# Altium project ITU_Rocket_Main_Board.PrjPcb
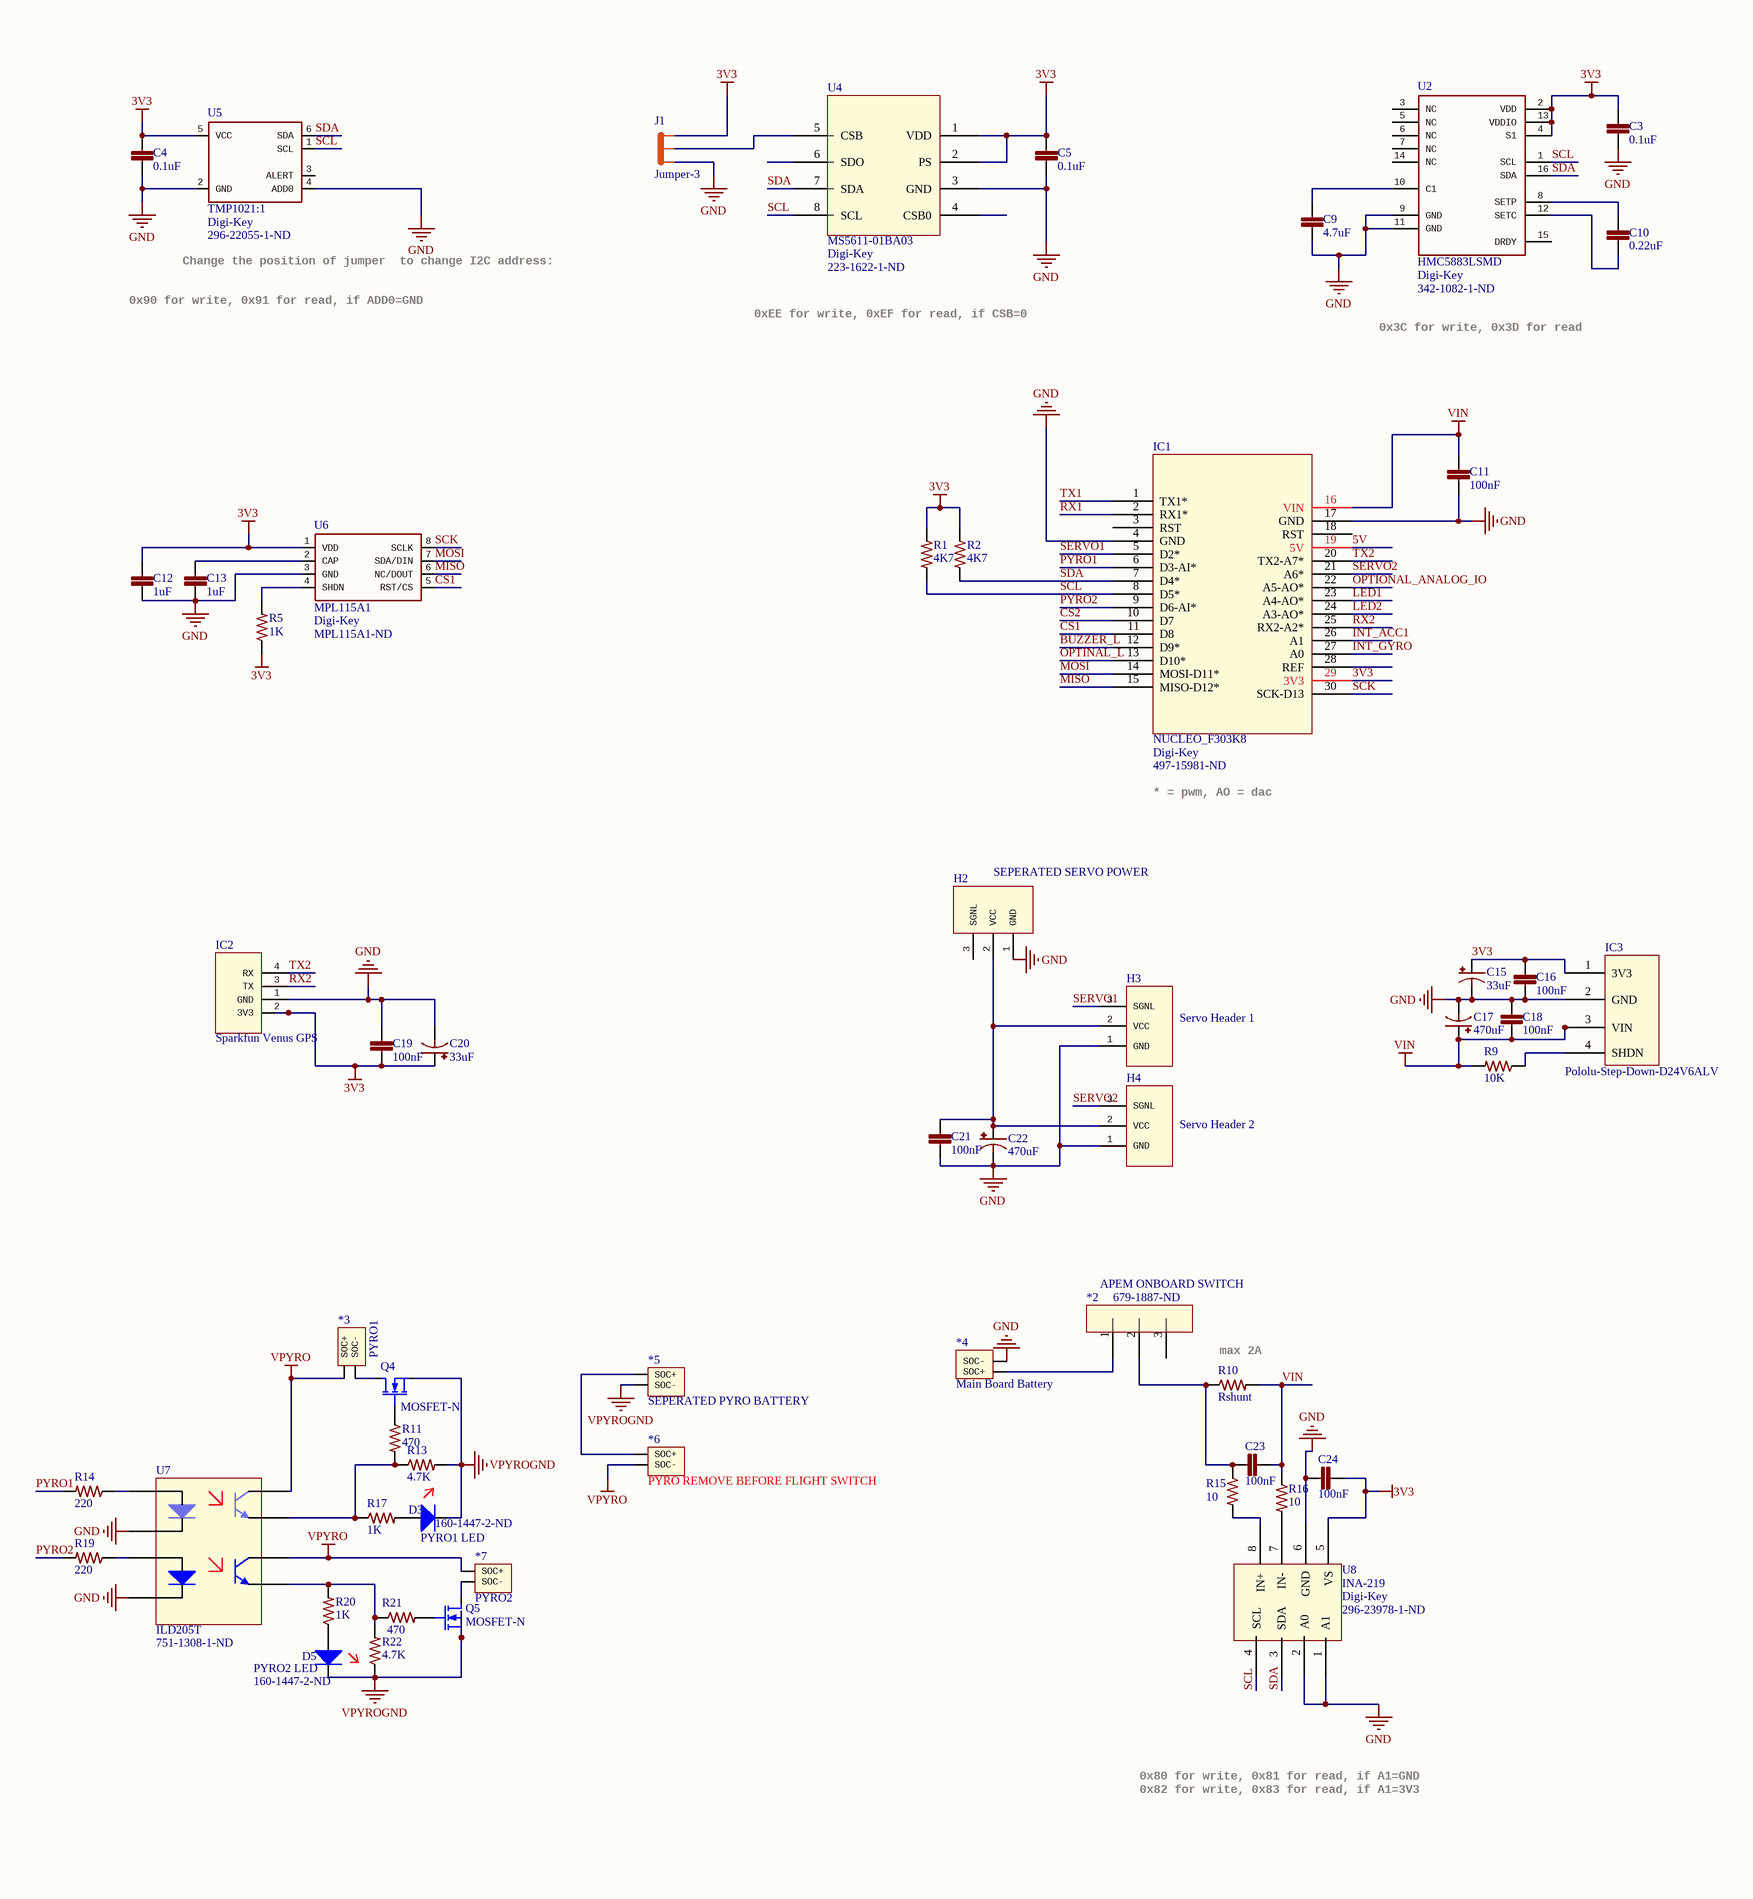
[diagram p0: ITU_Rocket_Main_Board.SchDoc, left]
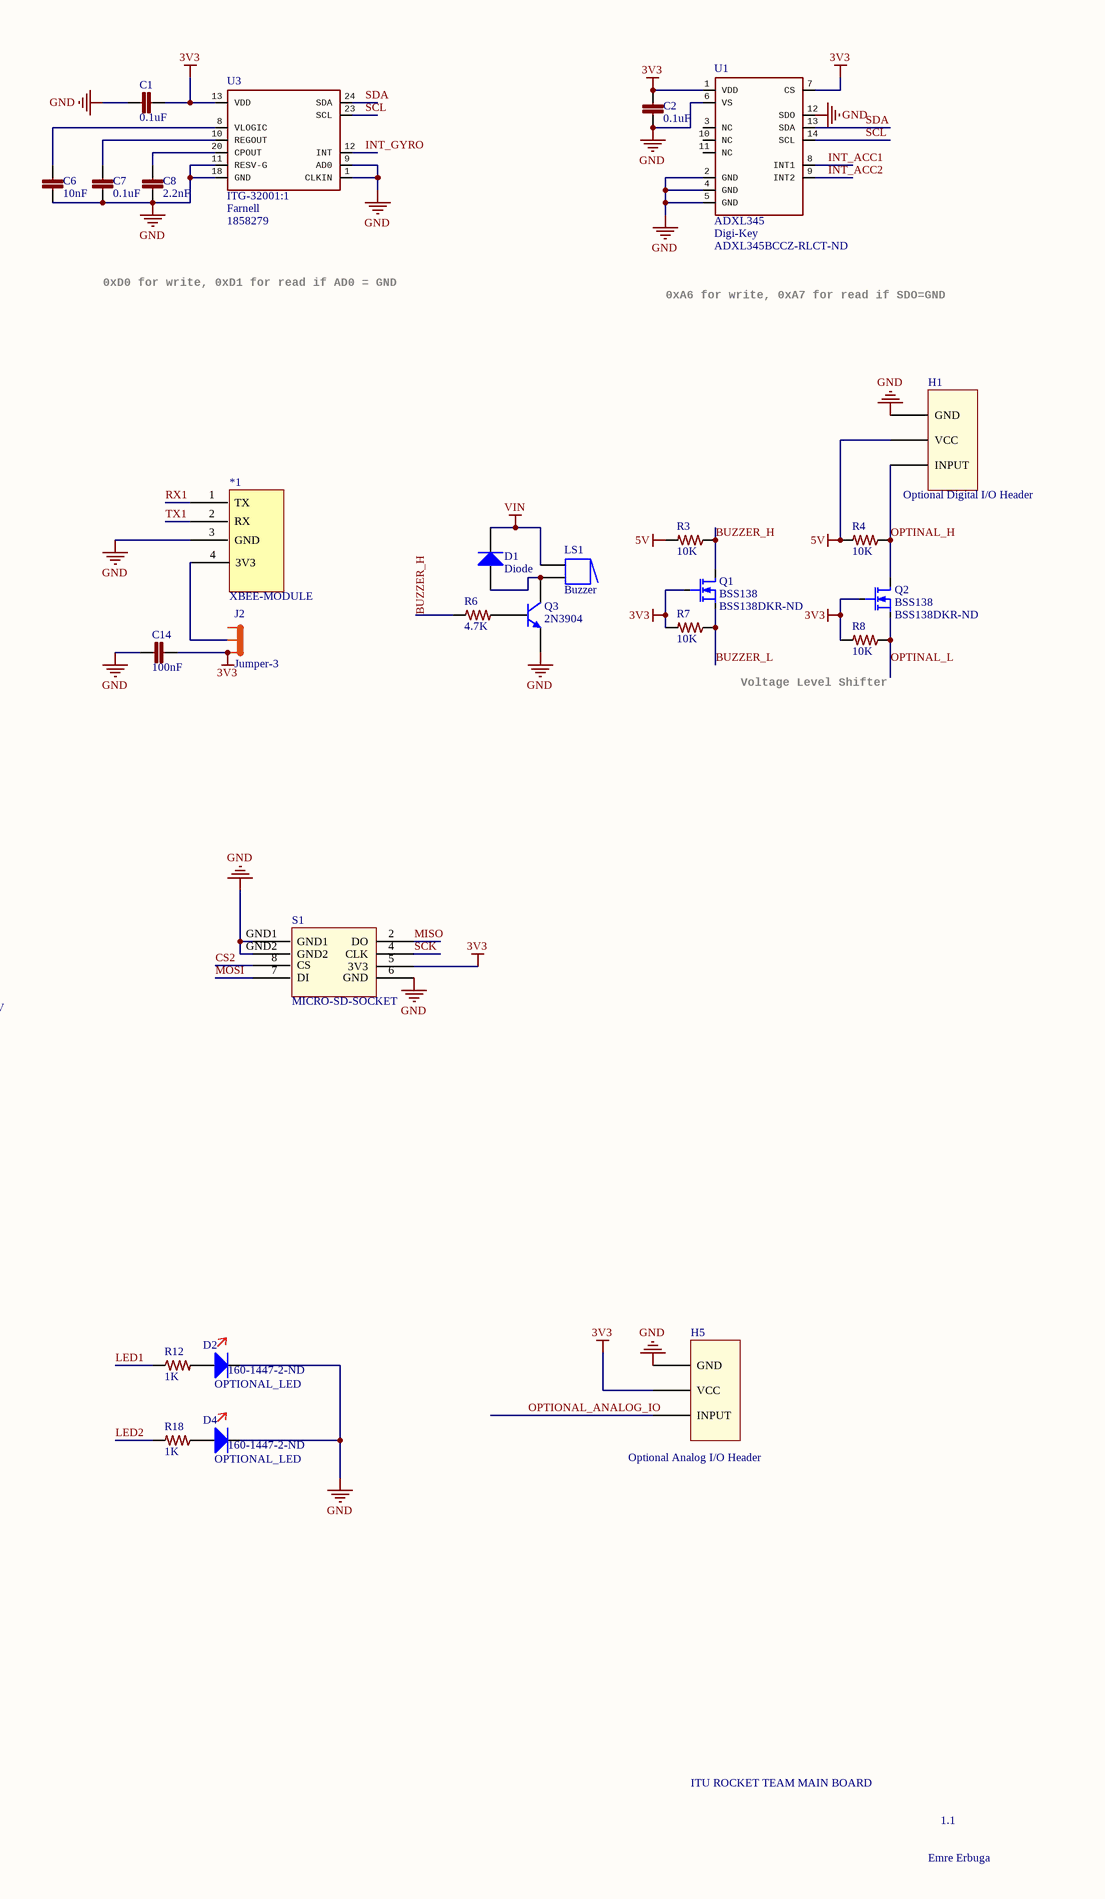
[diagram p1: ITU_Rocket_Main_Board.SchDoc, right]
1 sheet, 83 parts. Net scope: global (net labels, ports and power ports of the same name join across sheets).
Board file: ITU_Rocket_Main_Board.PcbDoc

## Sheet ITU_Rocket_Main_Board.SchDoc
size A2

### Parts
*1  XBEE-MODULE  [XBEE-MODULE]
*2  APEM ONBOARD SWITCH  Supplier Part Number 1: 679-1887-ND  [Switch_5.08]
*3  PYRO1  [POWER_SOCKET]
*4  Main Board Battery  [POWER_SOCKET]
*5  SEPERATED PYRO BATTERY  [POWER_SOCKET]
*6  PYRO REMOVE BEFORE FLIGHT SWITCH  [POWER_SOCKET]
*7  PYRO2  [POWER_SOCKET]
C1  0.1uF  [0603-CAP]
C2  0.1uF  [0603-CAP]
C3  0.1uF  [0603-CAP]
C4  0.1uF  [0603-CAP]
C5  0.1uF  [0603-CAP]
C6  10nF  [0603-CAP]
C7  0.1uF  [0603-CAP]
C8  2.2nF  [0603-CAP]
C9  4.7uF  [CAP0805-NP]
C10  0.22uF  [0603-CAP]
C11  100nF  [0603-CAP]
C12  1uF  [0603-CAP]
C13  1uF  [0603-CAP]
C14  100nF  [0603-CAP]
C15  33uF  [PANASONIC_C]
C16  100nF  [0603-CAP]
C17  470uF  [PANASONIC_E]
C18  100nF  [0603-CAP]
C19  100nF  [0603-CAP]
C20  33uF  [PANASONIC_C]
C21  100nF  [0603-CAP]
C22  470uF  [PANASONIC_E]
C23  100nF  [0603-CAP]
C24  100nF  [0603-CAP]
D1  Diode  [SMB]
D2  OPTIONAL_LED  Supplier Part Number 1: 160-1447-2-ND  [0603-SMD-LED]
D3  PYRO1 LED  Supplier Part Number 1: 160-1447-2-ND  [0603-SMD-LED]
D4  OPTIONAL_LED  Supplier Part Number 1: 160-1447-2-ND  [0603-SMD-LED]
D5  PYRO2 LED  Supplier Part Number 1: 160-1447-2-ND  [0603-SMD-LED]
H1  Header  [HEADER_3]  (value not drawn)
H2  SEPERATED SERVO POWER  [SERVO]
H3  Servo Header 1  [SERVO]
H4  Servo Header 2  [SERVO]
H5  Header  [HEADER_3]  (value not drawn)
IC1  NUCLEO_F303K8  Supplier 1: Digi-Key  Supplier Part Number 1: 497-15981-ND  [nucleo_f303]
IC2  Sparkfun Venus GPS  [SPARKFUN_VENUS_GPS]
IC3  Pololu-Step-Down-D24V6ALV  [Pololu-D24V6ALV]
J1  Jumper-3  [SJ_3]
J2  Jumper-3  [SJ_3]
LS1  Buzzer  [Buzzer-A3]
Q1  BSS138  Supplier Part Number 1: BSS138DKR-ND  [SOT23-3]
Q2  BSS138  Supplier Part Number 1: BSS138DKR-ND  [SOT23-3]
Q3  2N3904  [TO-92A]
Q4  MOSFET-N  [to-252]
Q5  MOSFET-N  [to-252]
R1  4K7  [0603-RES]
R2  4K7  [0603-RES]
R3  10K  [0603-RES]
R4  10K  [0603-RES]
R5  1K  [0603-RES]
R6  4.7K  [0603-RES]
R7  10K  [0603-RES]
R8  10K  [0603-RES]
R9  10K  [0603-RES]
R10  Rshunt  [Resistor-Shunt]
R11  470  [0603-RES]
R12  1K  [0603-RES]
R13  4.7K  [0603-RES]
R14  220  [0603-RES]
R15  10  [0603-RES]
R16  10  [0603-RES]
R17  1K  [0603-RES]
R18  1K  [0603-RES]
R19  220  [0603-RES]
R20  1K  [0603-RES]
R21  470  [0603-RES]
R22  4.7K  [0603-RES]
S1  MICRO-SD-SOCKET  [micro-sd]
U1  ADXL345  Supplier 1: Digi-Key  Supplier Part Number 1: ADXL345BCCZ-RLCT-ND  [LGA14]
U2  HMC5883LSMD  Supplier 1: Digi-Key  Supplier Part Number 1: 342-1082-1-ND  [16LPCC]
U3  ITG-32001:1  Supplier 1: Farnell  Supplier Part Number 1: 1858279  [QFN-24_ITG3200_1:1]
U4  MS5611-01BA03  Supplier 1: Digi-Key  Supplier Part Number 1: 223-1622-1-ND  [MS5611-01BA03]
U5  TMP1021:1  Supplier 1: Digi-Key  Supplier Part Number 1: 296-22055-1-ND  [SOT563-2]
U6  MPL115A1  Supplier 1: Digi-Key  Supplier Part Number 1: MPL115A1-ND  [LGA8]
U7  ILD205T  Supplier Part Number 1: 751-1308-1-ND  [SOIC-8-ILD205T]
U8  INA-219  Supplier 1: Digi-Key  Supplier Part Number 1: 296-23978-1-ND  [SOIC127P600X175-8N]

### Nets
3V3: C1.2 C2.1 C3.1 C4.1 C5.1 C12.1 C14.2 C15.+ C16.1 C19.2 C20.+ C24.2 H5.2(VCC) IC1.29(3V3) IC2.2(3V3) IC3.1(3V3) J1.3 J2.3 Q1.G Q2.G R1.1 R2.1 R5.1 R7.2 R8.2 S1.5(3V3) U1.1(VDD) U1.7(CS) U2.2(VDD) U2.4(S1) U2.13(VDDIO) U3.13(VDD) U4.1(VDD) U4.2(PS) U5.5(VCC) U6.1(VDD) U8.5(VS)
5V: H1.2(VCC) IC1.19(5V) R3.2 R4.2
GND: *1.3(GND) *4.-(SOC-) C1.1 C2.2 C3.2 C4.2 C5.2 C6.2 C7.2 C8.2 C9.2 C11.2 C12.2 C13.2 C14.1 C15.- C16.2 C17.- C18.1 C19.1 C20.- C21.2 C22.- C24.1 D2.2(K) D4.2(K) H1.1(GND) H2.1(GND) H3.1(GND) H4.1(GND) H5.1(GND) IC1.4(GND) IC1.17(GND) IC2.1(GND) IC3.2(GND) J1.1 Q3.1(E) S1.6(GND) S1.GND1 S1.GND2 U1.2(GND) U1.4(GND) U1.5(GND) U1.6(VS) U1.12(SDO) U2.9(GND) U2.11(GND) U3.1(CLKIN) U3.9(AD0) U3.11(RESV-G) U3.18(GND) U4.3(GND) U5.2(GND) U5.4(ADD0) U6.3(GND) U7.2(C) U7.4(C) U8.1(A1) U8.2(A0) U8.6(GND)
VIN: C11.1 C17.+ C18.2 C23.2 D1.2(K) IC1.16(VIN) IC3.3(VIN) LS1.1 R9.2 R10.+ R16.1
VPYRO: *3.+(SOC+) *6.-(SOC-) *7.+(SOC+) U7.6(C) U7.8(C)
VPYROGND: *5.-(SOC-) D3.2(K) D5.2(K) Q4.S Q5.S R13.2 R22.1
BUZZER_H: Q1.D R3.1 R6.1
BUZZER_L: IC1.12(D9*) Q1.S R7.1
CS1: IC1.11(D8) U6.5(RST/CS)
CS2: IC1.10(D7) S1.8(CS)
INT_ACC1: IC1.26(A1) U1.8(INT1)
INT_ACC2: U1.9(INT2)
INT_GYRO: IC1.27(A0) U3.12(INT)
LED1: IC1.23(A4-AO*) R12.1
LED2: IC1.24(A3-AO*) R18.2
MISO: IC1.15(MISO-D12*) S1.2(DO) U6.6(NC/DOUT)
MOSI: IC1.14(MOSI-D11*) S1.7(DI) U6.7(SDA/DIN)
OPTINAL_H: H1.3(INPUT) Q2.D R4.1
OPTINAL_L: IC1.13(D10*) Q2.S R8.1
OPTIONAL_ANALOG_IO: H5.3(INPUT) IC1.22(A5-AO*)
PYRO1: IC1.6(D3-AI*) R14.2
PYRO2: IC1.9(D6-AI*) R19.2
RX1: *1.1(TX) IC1.2(RX1*)
RX2: IC1.25(RX2-A2*) IC2.3(TX)
SCK: IC1.30(SCK-D13) S1.4(CLK) U6.8(SCLK)
SCL: IC1.8(D5*) R1.2 U1.14(SCL) U2.1(SCL) U3.23(SCL) U4.8(SCL) U5.1(SCL) U8.4(SCL)
SDA: IC1.7(D4*) R2.2 U1.13(SDA) U2.16(SDA) U3.24(SDA) U4.7(SDA) U5.6(SDA) U8.3(SDA)
SERVO1: H3.3(SGNL) IC1.5(D2*)
SERVO2: H4.3(SGNL) IC1.21(A6*)
TX1: *1.2(RX) IC1.1(TX1*)
TX2: IC1.20(TX2-A7*) IC2.4(RX)
Net*1_4: *1.4(3V3) J2.2
Net*2_1: *2.1 *4.+(SOC+)
Net*2_2: *2.2 C23.1 R10.- R15.1
Net*3_-: *3.-(SOC-) Q4.D
Net*5_+: *5.+(SOC+) *6.+(SOC+)
Net*7_-: *7.-(SOC-) Q5.D
NetC6_1: C6.1 U3.8(VLOGIC)
NetC7_1: C7.1 U3.10(REGOUT)
NetC8_1: C8.1 U3.20(CPOUT)
NetC9_1: C9.1 U2.10(C1)
NetC10_1: C10.1 U2.8(SETP)
NetC10_2: C10.2 U2.12(SETC)
NetC13_1: C13.1 U6.2(CAP)
NetC21_1: C21.1 C22.+ H2.2(VCC) H3.2(VCC) H4.2(VCC)
NetD1_1: D1.1(A) LS1.2 Q3.3(C)
NetD2_1: D2.1(A) R12.2
NetD3_1: D3.1(A) R17.2
NetD4_1: D4.1(A) R18.1
NetD5_1: D5.1(A) R20.1
NetIC3_4: IC3.4(SHDN) R9.1
NetJ1_2: J1.2 U4.5(CSB)
NetQ3_2: Q3.2(B) R6.2
NetQ4_G: Q4.G R11.1
NetQ5_G: Q5.G R21.2
NetR5_2: R5.2 U6.4(SHDN)
NetR11_2: R11.2 R13.1 R17.1 U7.7(E)
NetR14_1: R14.1 U7.1(A)
NetR15_2: R15.2 U8.8(IN+)
NetR16_2: R16.2 U8.7(IN-)
NetR19_1: R19.1 U7.3(A)
NetR20_2: R20.2 R21.1 R22.2 U7.5(E)

Not connected (* = marked no-connect by the designer): *2 3; H2 3(SGNL); IC1 3(RST) 18(RST) 28(REF); J2 1; U1 3(NC) 10(NC) 11(NC); U2 3(NC) 5(NC) 6(NC) 7(NC) 14(NC) 15(DRDY); U4 4(CSB0) 6(SDO); U5 3(ALERT)

### Notes on the sheet
- 0x90 for write, 0x91 for read, if ADD0=GND
- Change the position of jumper
  to change I2C address:
- 0xEE for write, 0xEF for read, if CSB=0
- 0xD0 for write, 0xD1 for read if AD0 = GND
- 0xA6 for write, 0xA7 for read if SDO=GND
- 0x3C for write, 0x3D for read
- (near H1) Optional Digital I/O Header
- (near R8) Voltage Level Shifter
- * = pwm, AO = dac
- (near R10) max 2A
- (near H5) Optional Analog I/O Header
- 0x80 for write, 0x81 for read, if A1=GND
- 0x82 for write, 0x83 for read, if A1=3V3
- ITU ROCKET TEAM MAIN BOARD
- Emre Erbuga
- 1.1

### Library data of the parts
*2 = 25136NAH: SWITCH SLIDE SPDT 4A 125V; Manufacturer: Apem Inc.; Contact Timing: Not Specified; Switch Function: On-On; Current Rating: 4A (AC), 1A (DC); Voltage Rating - DC: 30V; Actuator Type: Standard; Actuator Length: 2.80mm; Actuator Material: Polyamide (PA), Nylon, Glass Filled; Switch Travel: 4.00mm; Mechanical Life: 20,000 Cycles; Electrical Life: 10,000 Cycles; Supplier 1: Digi-Key; Manufacturer Part Number: 25136NAH; RoHS: RoHS Compliant; Category: Switches; Stock 1: 2924; Pricing 1: 1=4.57, 50=4.243, 100=3.0039, 250=2.96436, 500=2.45056, 1000=2.29245, 5000=2.13435 (USD); Packaging: Bulk; Circuit: SPDT; Voltage Rating - AC: 125V; Contact Material: Silver (Ag); Contact Finish: -; Mounting Type: Through Hole; Termination Style: PC Pin; Features: Epoxy Sealed Terminals; Operating Temperature: -40°C ~ 85°C; Operating Force: -; ComponentLink1URL: http://www.apem.com/files/apem/brochures/switch-slide-25000N-ENG.pdf; ComponentLink1Description: http://www.apem.com/files/apem/brochures/switch-slide-25000N-ENG.pdf
*3-*7 = Power-Terminal
C1-C14 C16 C18 C19 C21 C23 C24 = CAP0603-CAP: Manufacturer: Fairchild Semiconductor; Manufacturer Part Number: BSS138; FET Type: MOSFET N-Channel, Metal Oxide; FET Feature: Logic Level Gate; Drain to Source Voltage (Vdss): 50V; Current - Continuous Drain (Id) @ 25°C: 220mA (Ta); Rds On (Max) @ Id, Vgs: 3.5 Ohm @ 220mA, 10V; Vgs(th) (Max) @ Id: 1.5V @ 1mA; Gate Charge (Qg) @ Vgs: 2.4nC @ 10V; Input Capacitance (Ciss) @ Vds: 27pF @ 25V; Power - Max: 360mW; RoHS: RoHS Compliant; Category: Discrete Semiconductor Products; Packaging: Cut Tape (CT); Mounting Type: Surface Mount; Package / Case: TO-236-3, SC-59, SOT-23-3; Supplier Device Package: SOT-23; ComponentLink1URL: http://www.fairchildsemi.com/datasheets/BS/BSS138.pdf; ComponentLink1Description: http://www.fairchildsemi.com/datasheets/BS/BSS138.pdf
C15 C20 = CAP_PANASONIC_C
C17 C22 = CAP_PANASONIC_F
D1 = Diode: Default Diode; Published: 8-Jun-2000; LatestRevisionDate: 17-Jul-2002; LatestRevisionNote: Re-released for DXP Platform.; PackageVersion: Sep-1996; PackageReference: SMC; Publisher: Altium Limited; PackageDescription: DO-214-AB/SMC; 2 C-Bend Leads; Body 7.9 x 5.9 mm, inc. leads (LxW); Code_JEDEC: DO-214-AB
D2-D5 = LTST-C191KRKT: LED RED CLEAR 0603 SMD; Manufacturer: Lite-On Inc.; Lens Color: Colorless; Millicandela Rating: 54mcd; Lens Style/Size: Rectangle with Flat Top, 1.10mm x 0.80mm; Voltage - Forward (Vf) (Typ): 2V; Current - Test: 20mA; Viewing Angle: 130°; Wavelength - Dominant: 631nm; Wavelength - Peak: 639nm; Supplier 1: Digi-Key; Manufacturer Part Number: LTST-C191KRKT; RoHS: RoHS Compliant; Category: Optoelectronics; Stock 1: 305000; Pricing 1: 5000=0.03636, 10000=0.03272, 25000=0.02909, 50000=0.02636, 125000=0.02454 (USD); Packaging: Tape & Reel (TR); Color: Red; Lens Transparency: Clear; Mounting Type: Surface Mount; Features: -; Package / Case: 0603 (1608 Metric); Supplier Device Package: *; Size / Dimension: 1.60mm L x 0.80mm W; Height (Max): 0.55mm; ComponentLink1URL: http://optoelectronics.liteon.com/upload/download/DS22-2000-223/S_110_LTST-C191KRKT.pdf; ComponentLink1Description: http://optoelectronics.liteon.com/upload/download/DS22-2000-223/S_110_LTST-C191KRKT.pdf
H1 H5 = HEADER_3
H2-H4 = Servo-Header
IC1 = NUCLEO-32-F303K8
IC2 = Sparkfun-Venus-Gps
IC3 = Pololu-D24V6ALV
LS1 = Buzzer: Magnetic Transducer Buzzer; Published: 24-Mar-1999; LatestRevisionDate: 17-Dec-2003; LatestRevisionNote: Schematic revised, PCB Footprint replaced.; DatasheetVersion: 17-Dec-2003; PackageReference: ABSM-1574; Publisher: Altium Limited; PackageDescription: Magnetic Transducer Buzzer; ComponentLink1Description: Manufacturer Link; ComponentLink1URL: http://www.megastar.com/linecard/buzzmode/index.php
Q1 Q2 = BSS138: MOSFET N-CH 50V 220MA SOT-23; Manufacturer: Fairchild Semiconductor; FET Type: MOSFET N-Channel, Metal Oxide; FET Feature: Logic Level Gate; Current - Continuous Drain (Id) @ 25°C: 220mA (Ta); Rds On (Max) @ Id, Vgs: 3.5 Ohm @ 220mA, 10V; Vgs(th) (Max) @ Id: 1.5V @ 1mA; Gate Charge (Qg) @ Vgs: 2.4nC @ 10V; Input Capacitance (Ciss) @ Vds: 27pF @ 25V; Power - Max: 360mW; Supplier 1: Digi-Key; Manufacturer Part Number: BSS138; RoHS: RoHS Compliant; Category: Discrete Semiconductor Products; Stock 1: 382113; Pricing 1: 1=0.22, 10=0.178, 100=0.0945, 500=0.06214, 1000=0.04234 (USD); Packaging: Digi-Reel®; Drain to Source Voltage (Vdss): 50V; Mounting Type: Surface Mount; Package / Case: TO-236-3, SC-59, SOT-23-3; Supplier Device Package: SOT-23; ComponentLink1URL: http://www.fairchildsemi.com/datasheets/BS/BSS138.pdf; ComponentLink1Description: http://www.fairchildsemi.com/datasheets/BS/BSS138.pdf
Q3 = 2N3904: NPN General Purpose Amplifier; Published: 8-Jun-2000; LatestRevisionDate: 15-Jan-2003; LatestRevisionNote: PCB Footprint 'BCY-W3/D4.7' replaced; DatasheetVersion: 1997; PackageVersion: Sep-1998; PackageReference: TO-92A; Publisher: Altium Limited; PackageDescription: TO, Flat Index; 3 In-Line, Axial Leads; Body Dia. 4.5mm; Leads 0.51 x 0.48 mm (max); ComponentLink1Description: Manufacturer Link; ComponentLink1URL: http://www.fairchildsemi.com/; ComponentLink2Description: Datasheet; ComponentLink2URL: http://www.fairchildsemi.com/ds/2N%2F2N3904.pdf
Q4 Q5 = MOSFET-N: N-Channel MOSFET; Published: 8-Jun-2000; LatestRevisionDate: 17-Jul-2002; LatestRevisionNote: Re-released for DXP Platform.; PackageVersion: 1995/1996; PackageReference: E3; Publisher: Altium Limited; PackageDescription: TO, Flat Index; 3 In-Line, Axial Leads; Body Dia. 4.6mm; Lead Dia. 0.5 mm (max)
R1-R9 R11-R22 = RESISTOR0603
R10 = Resistor-Shunt
U2 = HMC5883LSMD: PROD_ID: IC-10284
U3 = ITG-32001:1: PROD_ID: IC-09685
U6 = MPL115A
U7 = ILD205T: OPTOISOLTR 4KV 2CH TRANS 8-SOIC; Manufacturer: Vishay Semiconductor Opto Division; Number of Channels: 2; Voltage - Isolation: 4000Vrms; Current Transfer Ratio (Min): 40% @ 10mA; Current Transfer Ratio (Max): 80% @ 10mA; Turn On / Turn Off Time (Typ): 6µs, 5µs; Rise / Fall Time (Typ): 3µs, 4.7µs; Input Type: DC; Output Type: Transistor; Voltage - Output (Max): 70V; Voltage - Forward (Vf) (Typ): 1.2V; Current - DC Forward (If) (Max): 30mA; Vce Saturation (Max): 400mV; Supplier 1: Digi-Key; Manufacturer Part Number: ILD205T; RoHS: RoHS Compliant; Category: Isolators; Stock 1: 3215; Pricing 1: 1=1.52, 10=1.213, 25=0.9268, 100=0.8425, 250=0.7414, 500=0.62346, 750=0.55605, 1000=0.5392 (USD); Packaging: Cut Tape (CT); Current - Output / Channel: -; Operating Temperature: -55°C ~ 100°C; Mounting Type: Surface Mount; Package / Case: 8-SOIC (0.154", 3.90mm Width); Supplier Device Package: 8-SOIC; ComponentLink1URL: http://www.vishay.com/docs/83647/ild205t.pdf; ComponentLink1Description: http://www.vishay.com/docs/83647/ild205t.pdf